# EAGLE design Ultrasonic (EAGLE 9.6.2)
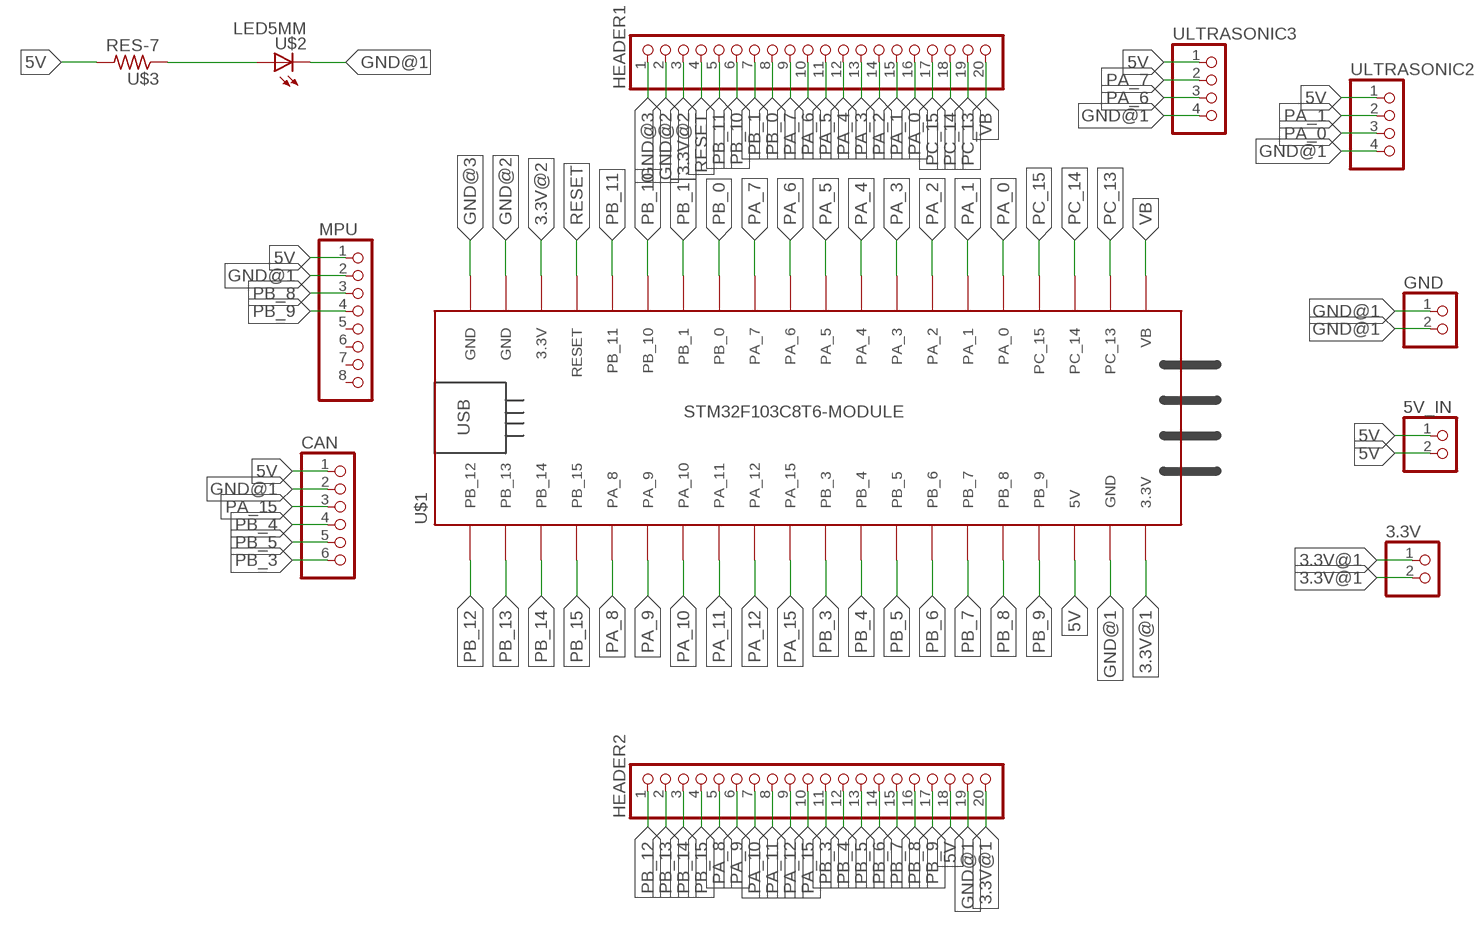
[diagram p0: schematic, sheet 1]

## Parts
3.3V  PINHD-2_DATA  [1X02_DATA]
5V_IN  PINHD-2_DATA  [1X02_DATA]
CAN  PINHD-6_DATA  [1X06_DATA]
GND  PINHD-2_DATA  [1X02_DATA]
HEADER1  PINHD-1X20  [1X20]
HEADER2  PINHD-1X20  [1X20]
MPU  PINHD-1X8  [1X08]
U$1  STM32F103C8T6-MODULE  [STM32F103C8T6-MODULE]
U$2  LED5MM  [LED5MM]
U$3  RES-7  [0204/7]
ULTRASONIC2  PINHD-4_DATA  [1X04_DATA]
ULTRASONIC3  PINHD-4_DATA  [1X04_DATA]

## Nets
3.3V@1: 3.3V.1 3.3V.2 HEADER2.20 U$1.3.3V_1(3.3V)
3.3V@2: HEADER1.3 U$1.3.3V_2(3.3V)
5V: 5V_IN.1 5V_IN.2 CAN.1 HEADER2.18 MPU.1 U$1.5V U$3.2 ULTRASONIC2.1 ULTRASONIC3.1
GND@1: CAN.2 GND.1 GND.2 HEADER2.19 MPU.2 U$1.GND_1(GND) U$2.K(C) ULTRASONIC2.4 ULTRASONIC3.4
GND@2: HEADER1.2 U$1.GND_2(GND)
GND@3: HEADER1.1 U$1.GND_3(GND)
N$1: U$2.A U$3.1
PA_0: HEADER1.16 U$1.PA_0 ULTRASONIC2.3
PA_1: HEADER1.15 U$1.PA_1 ULTRASONIC2.2
PA_2: HEADER1.14 U$1.PA_2
PA_3: HEADER1.13 U$1.PA_3
PA_4: HEADER1.12 U$1.PA_4
PA_5: HEADER1.11 U$1.PA_5
PA_6: HEADER1.10 U$1.PA_6 ULTRASONIC3.3
PA_7: HEADER1.9 U$1.PA_7 ULTRASONIC3.2
PA_8: HEADER2.5 U$1.PA_8
PA_9: HEADER2.6 U$1.PA_9
PA_10: HEADER2.7 U$1.PA_10
PA_11: HEADER2.8 U$1.PA_11
PA_12: HEADER2.9 U$1.PA_12
PA_15: CAN.3 HEADER2.10 U$1.PA_15
PB_0: HEADER1.8 U$1.PB_0
PB_1: HEADER1.7 U$1.PB_1
PB_3: CAN.6 HEADER2.11 U$1.PB_3
PB_4: CAN.4 HEADER2.12 U$1.PB_4
PB_5: CAN.5 HEADER2.13 U$1.PB_5
PB_6: HEADER2.14 U$1.PB_6
PB_7: HEADER2.15 U$1.PB_7
PB_8: HEADER2.16 MPU.3 U$1.PB_8
PB_9: HEADER2.17 MPU.4 U$1.PB_9
PB_10: HEADER1.6 U$1.PB_10
PB_11: HEADER1.5 U$1.PB_11
PB_12: HEADER2.1 U$1.PB_12
PB_13: HEADER2.2 U$1.PB_13
PB_14: HEADER2.3 U$1.PB_14
PB_15: HEADER2.4 U$1.PB_15
PC_13: HEADER1.19 U$1.PC_13
PC_14: HEADER1.18 U$1.PC_14
PC_15: HEADER1.17 U$1.PC_15
RESET: HEADER1.4 U$1.RESET
VB: HEADER1.20 U$1.VB
Unconnected: MPU.5 MPU.6 MPU.7 MPU.8

## Library data of the parts
3.3V 5V_IN GND = ALL:PINHD-2_DATA: PIN HEADER
CAN = ALL:PINHD-6_DATA: PIN HEADER
HEADER1 HEADER2 = ALL:PINHD-1X20: PIN HEADER
MPU = ALL:PINHD-1X8: PIN HEADER
U$1 = ALL:STM32F103C8T6-MODULE: STM32F103C8T6 module with ARM Cortex-3, 20kB SRAM, 64kB Flash, 72MHz
U$2 = ALL:LED5MM
U$3 = ALL:RES-7
ULTRASONIC2 ULTRASONIC3 = ALL:PINHD-4_DATA: PIN HEADER

## Board
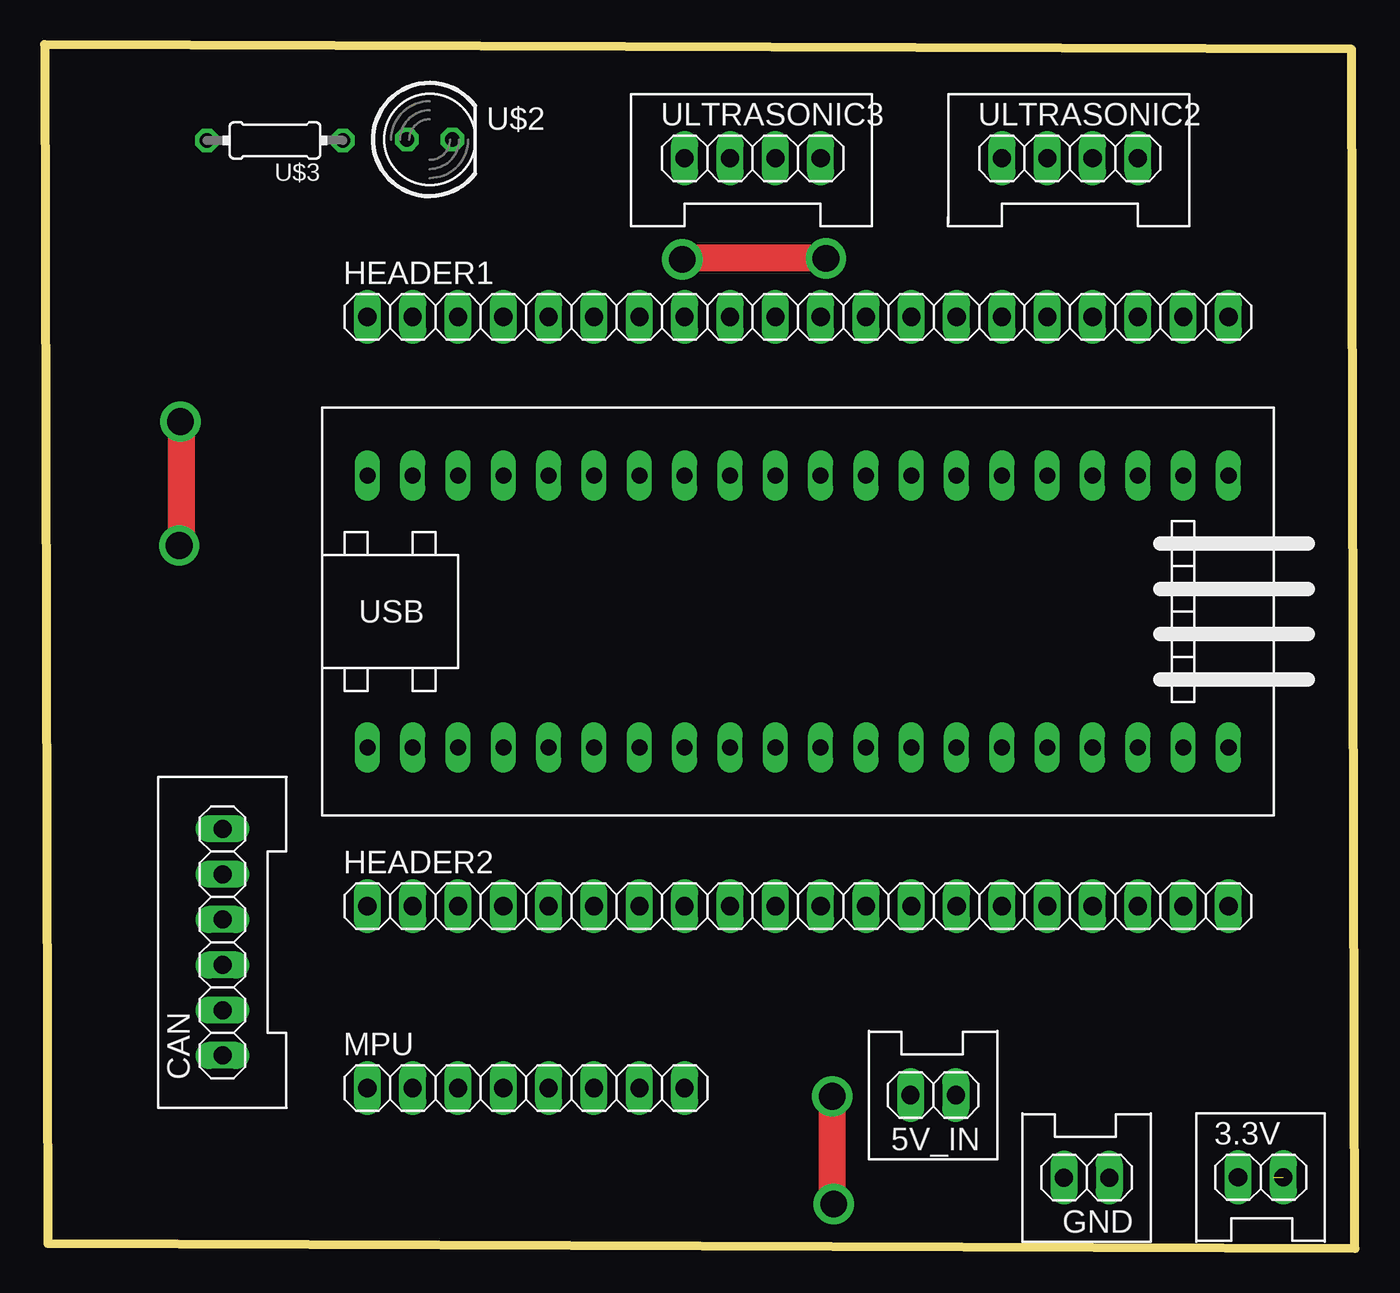
[diagram p1: board, top side]
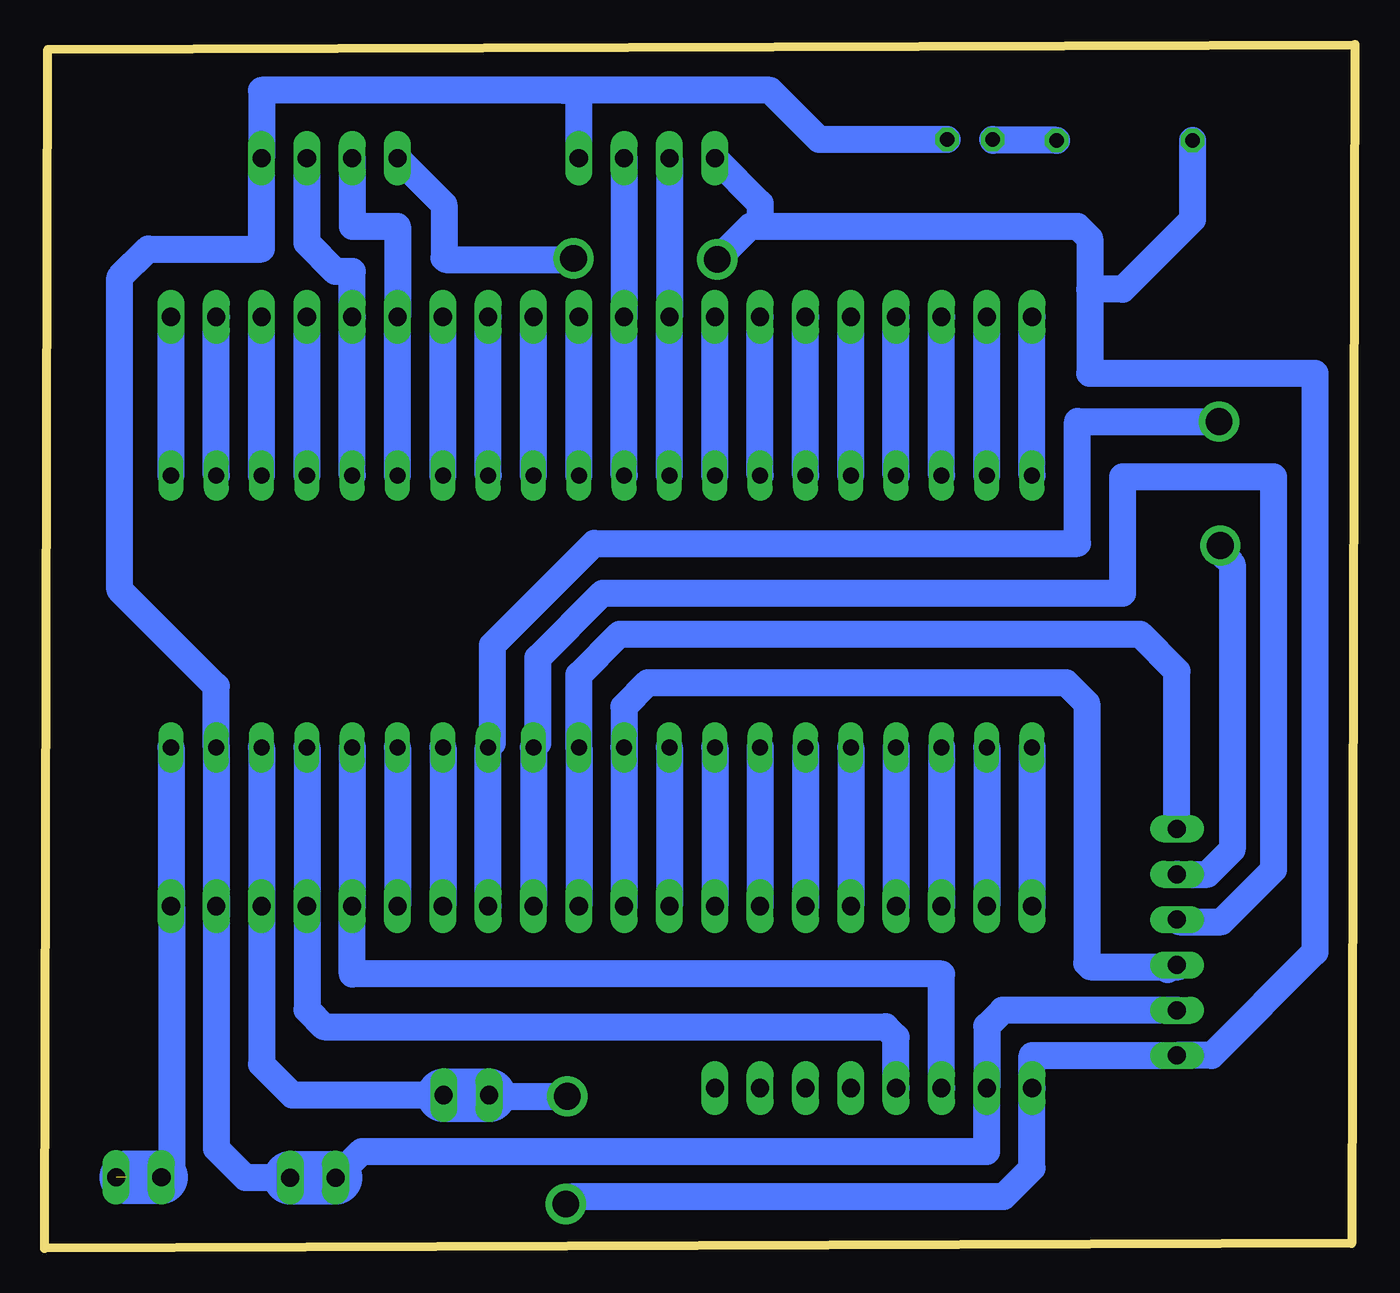
[diagram p2: board, bottom side, seen from below]

Size 73.43 x 67.46 mm. Coordinates in mm from the lower left corner, seen from the top.
Outline: 0.18,0.27 73.43,0 73.25,67.19 0,67.46 0.18,0.27
Copper layers (1*16): Top 0.035mm / dielectric 1.5mm / Bottom 0.035mm
Design rules "default *": minimum track width 0.8mm, minimum drill 0.8mm, track to track 0.8mm, track to pad 0.8mm, pad to pad 6mil, via to via 6mil, smd to smd 6mil, copper to edge 40mil, drill to drill 6mil, minimum pad ring 10mil, minimum via ring 8mil, stop-mask expansion 4mil, vias tented up to drill 0mil, thermal gap 10mil

### Footprints (pad centres in the part's own frame; a part is rotated, then mirrored left to right if it is on the bottom)
1X02_DATA = drill 1.016 long: 1 -1.27,0; 2 1.27,0
1X06_DATA = drill 1.016 long: 1 -6.35,0; 2 -3.81,0; 3 -1.27,0; 4 1.27,0; 5 3.81,0; 6 6.35,0
1X20 = drill 1.016 long: 1 -24.13,0; 2 -21.59,0; 3 -19.05,0; 4 -16.51,0; 5 -13.97,0; 6 -11.43,0; 7 -8.89,0; 8 -6.35,0; 9 -3.81,0; 10 -1.27,0; 11 1.27,0; 12 3.81,0; 13 6.35,0; 14 8.89,0; 15 11.43,0; 16 13.97,0; 17 16.51,0; 18 19.05,0; 19 21.59,0; 20 24.13,0
1X08 = drill 1.016 long: 1 -8.89,0; 2 -6.35,0; 3 -3.81,0; 4 -1.27,0; 5 1.27,0; 6 3.81,0; 7 6.35,0; 8 8.89,0
STM32F103C8T6-MODULE = drill 0.9 long: 3.3V_1 25.4,-7.62; 3.3V_2 -17.78,7.62; 5V 20.32,-7.62; GND_1 22.86,-7.62; GND_2 -20.32,7.62; GND_3 -22.86,7.62; PA_0 15.24,7.62; PA_1 12.7,7.62; PA_2 10.16,7.62; PA_3 7.62,7.62; PA_4 5.08,7.62; PA_5 2.54,7.62; PA_6 0,7.62; PA_7 -2.54,7.62; PA_8 -12.7,-7.62; PA_9 -10.16,-7.62; PA_10 -7.62,-7.62; PA_11 -5.08,-7.62; PA_12 -2.54,-7.62; PA_15 0,-7.62; PB_0 -5.08,7.62; PB_1 -7.62,7.62; PB_3 2.54,-7.62; PB_4 5.08,-7.62; PB_5 7.62,-7.62; PB_6 10.16,-7.62; PB_7 12.7,-7.62; PB_8 15.24,-7.62; PB_9 17.78,-7.62; PB_10 -10.16,7.62; PB_11 -12.7,7.62; PB_12 -22.86,-7.62; PB_13 -20.32,-7.62; PB_14 -17.78,-7.62; PB_15 -15.24,-7.62; PC_13 22.86,7.62; PC_14 20.32,7.62; PC_15 17.78,7.62; RESET -15.24,7.62; VB 25.4,7.62
LED5MM = drill 0.813 octagon: A -1.27,0; K 1.27,0
0204/7 = drill 0.813 octagon: 1 -3.81,0; 2 3.81,0
1X04_DATA = drill 1.016 long: 1 -3.81,0; 2 -1.27,0; 3 1.27,0; 4 3.81,0

### Placement (x,y rotation side)
3.3V  68.15,3.98 0 top
5V_IN  49.8,8.59 180 top
CAN  9.97,17.16 90 top
GND  58.4,3.96 180 top
HEADER1  42.22,52.2 0 top
HEADER2  42.22,19.18 0 top
MPU  26.98,8.98 0 top
U$1  40.95,35.69 0 top
U$2  21.58,62.14 0 top
U$3  12.91,62.09 180 top
ULTRASONIC2  57.46,61.09 0 top
ULTRASONIC3  39.68,61.09 0 top

### Tracks (layer width: path | path; a pad name or v marks a point on that pad's centre or on a via)
3.3V@1  (1 unrouted)
  Bottom 1.5: U$1.3.3V_1 HEADER2.20 66.31,19.14 66.31,4.55 3.3V.1
  Bottom 3: 3.3V.1 68.85,3.98
3.3V@2
  Bottom 1.5: U$1.3.3V_2 HEADER1.3
5V  (via drill 1.5)
  Top 1.5: v44.13,8.52 44.13,2.57 v44.22,2.48 | v43.78,55.48 35.8,55.48 v35.73,55.42
  Bottom 1.5: U$1.5V HEADER2.18 61.27,10.32 59.54,8.59 5V_IN.1 | ULTRASONIC3.1 33.33,58.55 33.33,57.28 | 33.33,57.28 15.55,57.28 14.86,56.59 14.86,53.75 | 14.86,53.75 14.86,49.04 2.23,49.04 2.23,16.6 8.03,10.8 CAN.1 18.09,10.8 MPU.1 18.09,4.5 19.68,2.91 43.8,2.91 v44.22,2.48 | 53.16,60.6 ULTRASONIC2.1 51.05,58.49 51.05,55.52 50.95,55.42 43.84,55.42 v43.78,55.48 | 5V_IN.2 48.46,8.52 v44.13,8.52 | v35.73,55.42 33.88,57.28 33.33,57.28 | U$3.2 9.1,57.66 13.01,53.75 14.86,53.75
  Bottom 3: 5V_IN.2 5V_IN.1
GND@1
  Bottom 1.5: CAN.2 19.73,13.35 20.63,12.44 MPU.2 20.63,5.43 55.66,5.43 GND.2 62.18,3.96 63.81,5.6 HEADER2.19 U$1.GND_1 63.81,31.5 69.21,36.9 69.21,54.42 67.62,56.01 61.27,56.01 ULTRASONIC2.4 61.27,64.9 44.32,64.9 43.49,64.9 | ULTRASONIC3.4 43.49,64.9 | U$2.K 30.01,62.14 32.77,64.9 43.49,64.9
  Bottom 3: GND.2 GND.1
GND@2
  Bottom 1.5: U$1.GND_2 HEADER1.2
GND@3
  Bottom 1.5: U$1.GND_3 HEADER1.1
N$1
  Bottom 1.5: U$3.1 20.26,62.09 U$2.A
PA_0
  Bottom 1.5: U$1.PA_0 HEADER1.16 56.19,54.75 57.14,54.75 58.73,56.34 ULTRASONIC2.3
PA_1
  Bottom 1.5: U$1.PA_1 HEADER1.15 53.65,57.28 56.19,57.28 ULTRASONIC2.2
PA_2
  Bottom 1.5: U$1.PA_2 HEADER1.14
PA_3
  Bottom 1.5: U$1.PA_3 HEADER1.13
PA_4
  Bottom 1.5: U$1.PA_4 HEADER1.12
PA_5
  Bottom 1.5: U$1.PA_5 HEADER1.11
PA_6
  Bottom 1.5: U$1.PA_6 HEADER1.10 ULTRASONIC3.3
PA_7
  Bottom 1.5: U$1.PA_7 HEADER1.9 ULTRASONIC3.2
PA_8
  Bottom 1.5: U$1.PA_8 HEADER2.5
PA_9
  Bottom 1.5: U$1.PA_9 HEADER2.6
PA_10
  Bottom 1.5: U$1.PA_10 HEADER2.7
PA_11
  Bottom 1.5: U$1.PA_11 HEADER2.8
PA_12
  Bottom 1.5: U$1.PA_12 HEADER2.9
PA_15
  Bottom 1.5: HEADER2.10 U$1.PA_15 40.97,28.09 40.97,30.37 39.64,31.7 16.18,31.7 15.03,30.54 15.03,15.98 14.83,15.79 10.49,15.79 10.32,15.79 | 10.32,15.79 9.87,15.79 CAN.3 | 10.32,15.79 10.49,15.62
PB_0
  Bottom 1.5: U$1.PB_0 HEADER1.8
PB_1
  Bottom 1.5: U$1.PB_1 HEADER1.7
PB_3
  Bottom 1.5: HEADER2.11 U$1.PB_3 43.49,32.14 41.21,34.42 12.03,34.42 9.97,32.35 CAN.6
PB_4
  Bottom 1.5: HEADER2.12 U$1.PB_4 45.79,28.31 45.79,33.09 42.16,36.72 13.01,36.72 13.01,43.24 4.56,43.24 4.56,21.21 7.48,18.3 9.84,18.3 CAN.4
PB_5  (via drill 1.5)
  Top 1.5: v7.54,39.39 7.64,39.39 7.64,46.34 v7.61,46.34
  Bottom 1.5: HEADER2.13 U$1.PB_5 48.33,28.31 48.33,33.8 42.63,39.5 15.55,39.5 15.55,46.34 v7.61,46.34 | v7.54,39.39 7.54,39 6.88,38.34 6.88,22.34 8.26,20.96 CAN.5
PB_6
  Bottom 1.5: U$1.PB_6 HEADER2.14
PB_7
  Bottom 1.5: U$1.PB_7 HEADER2.15
PB_8
  Bottom 1.5: U$1.PB_8 HEADER2.16 56.19,15.37 23.17,15.37 MPU.3
PB_9
  Bottom 1.5: U$1.PB_9 HEADER2.17 58.73,13.39 57.77,12.42 26.3,12.42 25.71,11.83 MPU.4
PB_10
  Bottom 1.5: U$1.PB_10 HEADER1.6
PB_11
  Bottom 1.5: U$1.PB_11 HEADER1.5
PB_12
  Bottom 1.5: U$1.PB_12 HEADER2.1
PB_13
  Bottom 1.5: U$1.PB_13 HEADER2.2
PB_14
  Bottom 1.5: U$1.PB_14 HEADER2.3
PB_15
  Bottom 1.5: U$1.PB_15 HEADER2.4
PC_13
  Bottom 1.5: U$1.PC_13 HEADER1.19
PC_14
  Bottom 1.5: U$1.PC_14 HEADER1.18
PC_15
  Bottom 1.5: U$1.PC_15 HEADER1.17
RESET
  Bottom 1.5: U$1.RESET HEADER1.4
VB
  Bottom 1.5: U$1.VB HEADER1.20